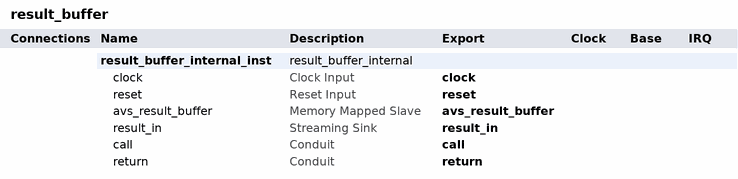
[diagram p0: system contents]
# Platform Designer (Qsys) system result_buffer, MAX 10 10M50DAF672I7G
# Parameters at their usual value, and those the tool derives, are not listed.
package require qsys
create_system result_buffer
set_project_property DEVICE_FAMILY {MAX 10}
set_project_property DEVICE 10M50DAF672I7G

add_instance result_buffer_internal_inst result_buffer_internal 1.0
set_instance_property result_buffer_internal_inst AUTO_EXPORT true

# exported interfaces
add_interface avs_result_buffer avalon slave
set_interface_property avs_result_buffer EXPORT_OF result_buffer_internal_inst.avs_result_buffer
add_interface call conduit end
set_interface_property call EXPORT_OF result_buffer_internal_inst.call
add_interface clock clock sink
set_interface_property clock EXPORT_OF result_buffer_internal_inst.clock
add_interface reset reset sink
set_interface_property reset EXPORT_OF result_buffer_internal_inst.reset
add_interface result_in avalon_streaming sink
set_interface_property result_in EXPORT_OF result_buffer_internal_inst.result_in
add_interface return conduit end
set_interface_property return EXPORT_OF result_buffer_internal_inst.return

set_interconnect_requirement {$system} qsys_mm.clockCrossingAdapter HANDSHAKE
set_interconnect_requirement {$system} qsys_mm.enableEccProtection FALSE
set_interconnect_requirement {$system} qsys_mm.insertDefaultSlave FALSE
set_interconnect_requirement {$system} qsys_mm.maxAdditionalLatency 1

save_system result_buffer.qsys
